# Altium schematic sheet TELM0004_CurrentSense.SchDoc: Telemetry Current Sense
size A3; Engineer: A. SHAW; Organization: BLUEsat Project; Address1: Room 419; Address2: School of EE&T; Address3: UNSW, NSW 2052; Address4: Australia; DocumentNumber: TELM0004; SheetNumber: 1; SheetTotal: 1; Description: Converts Current to Voltage 500mV/A; Version: 1.0
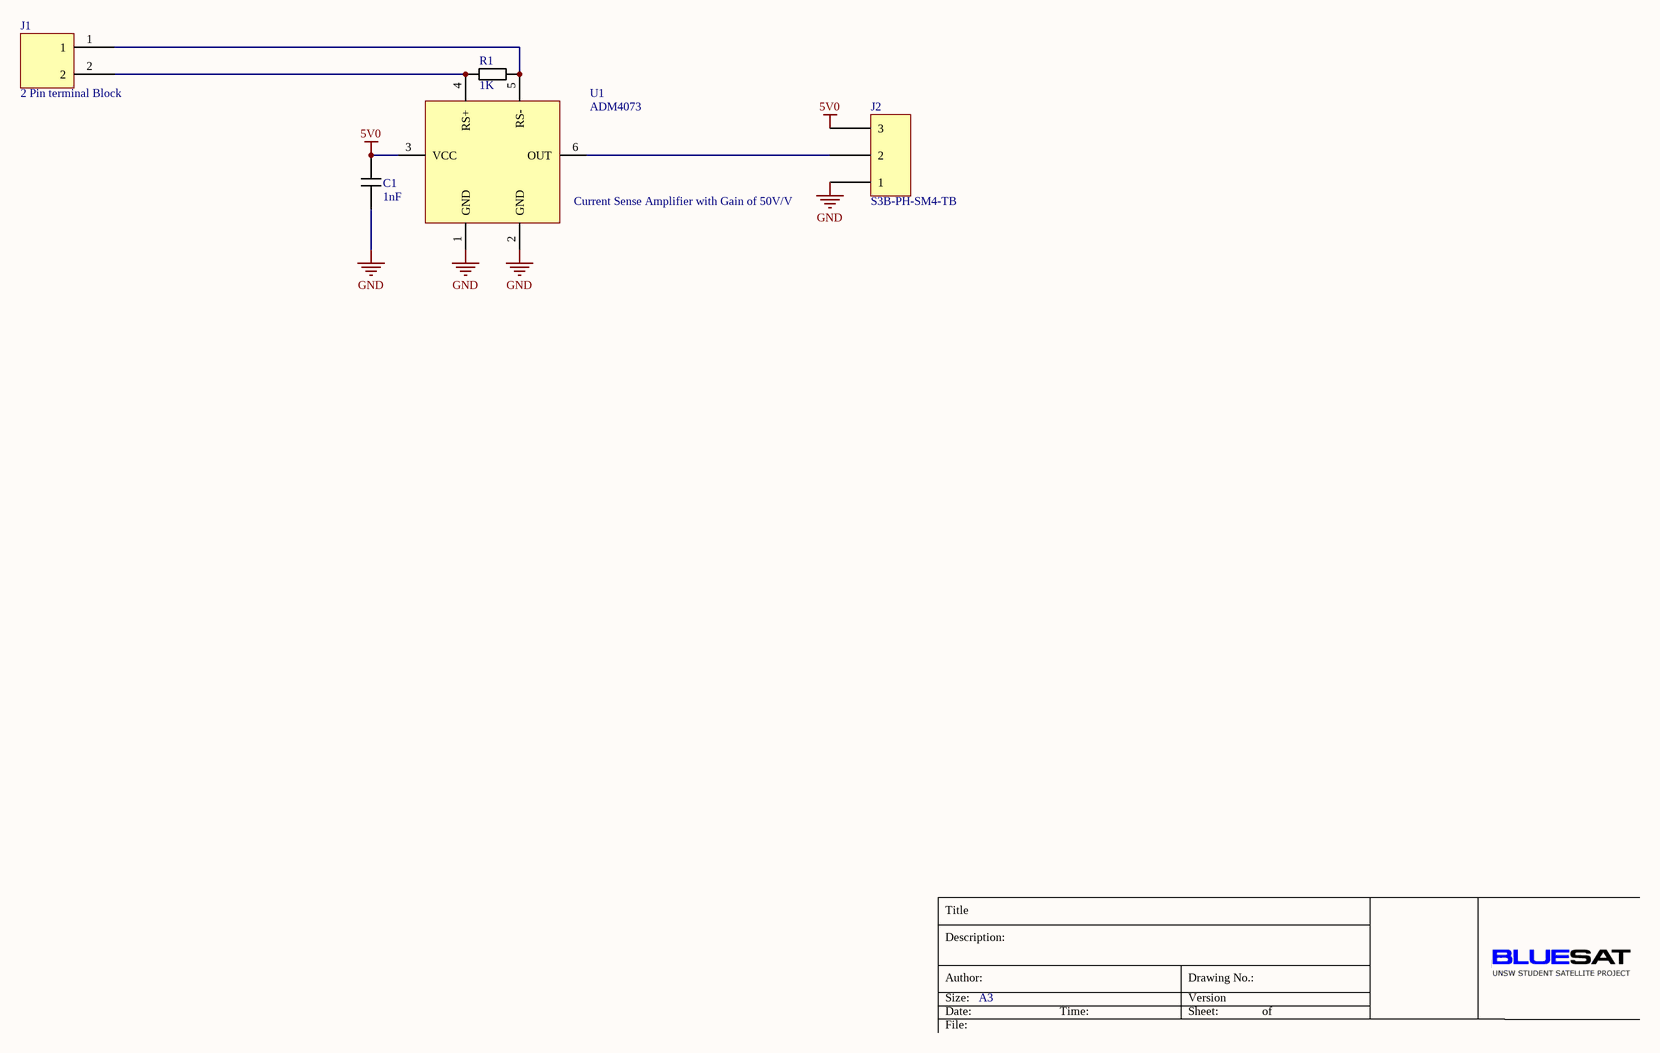
[diagram p0: TELM0004_CurrentSense.SchDoc]

## Parts
C1  value 1nF  [1206 Cap]  (hidden comment: 1206 Cap)
J1  2 Pin terminal Block  [5.05mm Terminal Block - 2]
J2  S3B-PH-SM4-TB  [S3B-PH-SM4-TB]
R1  value 1K  [0603 Resistor]  (hidden comment: 0603 Resistor)
U1  ADM4073  [SOT95P285X145-6N]

## Nets
5V0: C1.2 J2.3 U1.3(VCC)
GND: C1.1 J2.1 U1.1(GND) U1.2(GND)
NetJ1_1: J1.1 R1.2 U1.5(RS-)
NetJ1_2: J1.2 R1.1 U1.4(RS+)
NetJ2_2: J2.2 U1.6(OUT)

## Notes on the sheet
- (near U1) Current Sense Amplifier with Gain of 50V/V
- Title
- Description:
- Size:
- Author:
- Date:
- A3
- Time:
- Version
- Sheet:
- Drawing No.:
- of
- File:

## Library data of the parts
C1 = 1206 MLCC - X7R, 10%
J1 = 2 Terminal Block
J2 = S3B-PH-SM4-TB: JST connector
R1 = 0603 Thin Film Resistor 0.1%
U1 = ADM4073: Current Sense Amplifer